# Altium schematic sheet MAIN BOARD V1.3.SchDoc
size A3
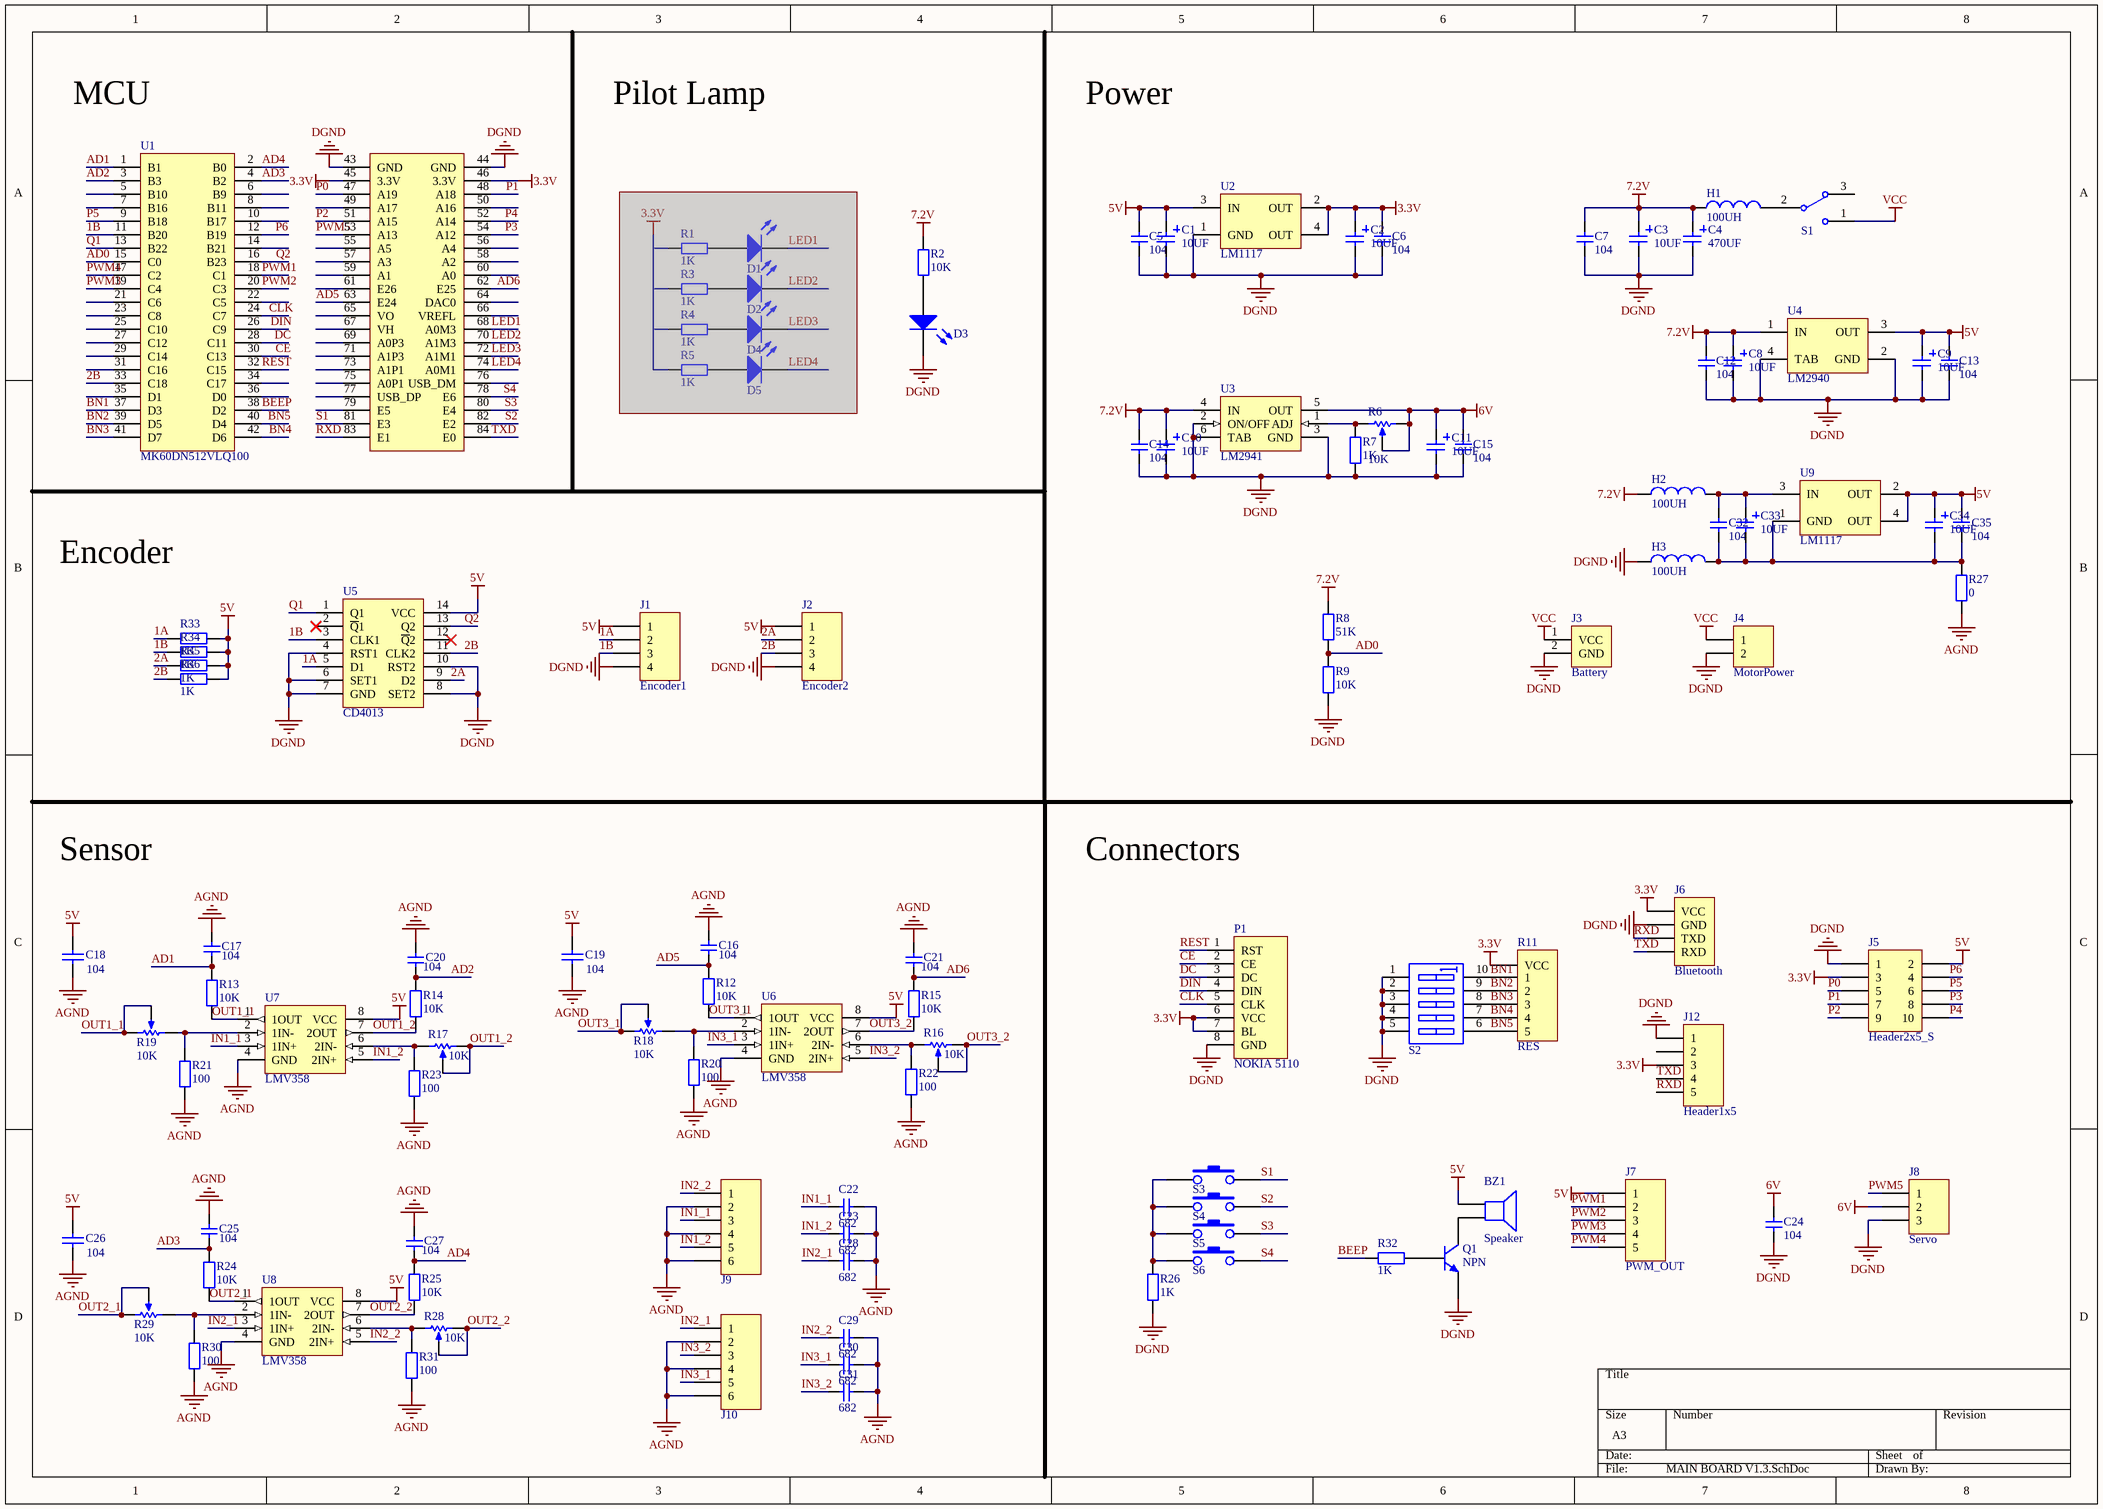
[diagram p0: MAIN BOARD V1.3.SchDoc]

## Parts
BZ1  Speaker  [SPEAKER]
C1  CAP_3216(1206)  [CAP_3216（1206）]  (value not drawn)
C2  CAP_3216(1206)  [CAP_3216（1206）]  (value not drawn)
C3  CAP_3216(1206)  [CAP_3216（1206）]  (value not drawn)
C4  CAP_220UF  [CAP_DIP_8×11.5]  (value not drawn)
C5  CAP_0805  [C0805]  (value not drawn)
C6  CAP_0805  [C0805]  (value not drawn)
C7  CAP_0805  [C0805]  (value not drawn)
C8  CAP_3216(1206)  [CAP_3216（1206）]  (value not drawn)
C9  CAP_3216(1206)  [CAP_3216（1206）]  (value not drawn)
C10  CAP_3216(1206)  [CAP_3216（1206）]  (value not drawn)
C11  CAP_3216(1206)  [CAP_3216（1206）]  (value not drawn)
C12  CAP_0805  [C0805]  (value not drawn)
C13  CAP_0805  [C0805]  (value not drawn)
C14  CAP_0805  [C0805]  (value not drawn)
C15  CAP_0805  [C0805]  (value not drawn)
C16  CAP_0805  [C0805]  (value not drawn)
C17  CAP_0805  [C0805]  (value not drawn)
C18  CAP_0805  [C0805]  (value not drawn)
C19  CAP_0805  [C0805]  (value not drawn)
C20  CAP_0805  [C0805]  (value not drawn)
C21  CAP_0805  [C0805]  (value not drawn)
C22  CAP_682  [CAP_682]  (value not drawn)
C23  CAP_682  [CAP_682]  (value not drawn)
C24  CAP_0805  [C0805]  (value not drawn)
C25  CAP_0805  [C0805]  (value not drawn)
C26  CAP_0805  [C0805]  (value not drawn)
C27  CAP_0805  [C0805]  (value not drawn)
C28  CAP_682  [CAP_682]  (value not drawn)
C29  CAP_682  [CAP_682]  (value not drawn)
C30  CAP_682  [CAP_682]  (value not drawn)
C31  CAP_682  [CAP_682]  (value not drawn)
C32  CAP_0805  [C0805]  (value not drawn)
C33  CAP_3216(1206)  [CAP_3216（1206）]  (value not drawn)
C34  CAP_3216(1206)  [CAP_3216（1206）]  (value not drawn)
C35  CAP_0805  [C0805]  (value not drawn)
D1  LED_0805_R  [LED_0805_R]  (value not drawn)  (masked out: inside a compile mask, not in the netlist)
D2  LED_0805_Y  [LED_0805_Y]  (value not drawn)  (masked out: inside a compile mask, not in the netlist)
D3  LED_3528_R  [LED_3528_R]  (value not drawn)
D4  LED_0805_G  [LED_0805_G]  (value not drawn)  (masked out: inside a compile mask, not in the netlist)
D5  LED_0805_B  [LED_0805_B]  (value not drawn)  (masked out: inside a compile mask, not in the netlist)
H1  Inductor_SMD  [R0805]  (value not drawn)
H2  Inductor_SMD  [R0805]  (value not drawn)
H3  Inductor_SMD  [R0805]  (value not drawn)
J1  Encoder1  [HEADER1X4]
J2  Encoder2  [HEADER1X4]
J3  Battery  [TERMINAL_T]
J4  MotorPower  [HEADER-5.08]
J5  Header2x5_S  [HEADER2X5_S]
J6  Bluetooth  [HEADER1X4]
J7  PWM_OUT  [HEADER1X5]
J8  Servo  [HEADER1X3]
J9  Header1x6  [HEADER1X6]  (value not drawn)
J10  Header1x6  [HEADER1X6]  (value not drawn)
J12  Header1x5  [HEADER1X5]
P1  NOKIA 5110  [NOKIA 5110_1P]
Q1  NPN  [SOT-23]
R1  RES  [R0805]  (value not drawn)  (masked out: inside a compile mask, not in the netlist)
R2  RES  [R0805]  (value not drawn)
R3  RES  [R0805]  (value not drawn)  (masked out: inside a compile mask, not in the netlist)
R4  RES  [R0805]  (value not drawn)  (masked out: inside a compile mask, not in the netlist)
R5  RES  [R0805]  (value not drawn)  (masked out: inside a compile mask, not in the netlist)
R6  RES_Change_P  [RES_Change_P]  (value not drawn)
R7  RES  [R0805]  (value not drawn)
R8  RES  [R0805]  (value not drawn)
R9  RES  [R0805]  (value not drawn)
R11  RES  [RES_6P]
R12  RES  [R0805]  (value not drawn)
R13  RES  [R0805]  (value not drawn)
R14  RES  [R0805]  (value not drawn)
R15  RES  [R0805]  (value not drawn)
R16  RES_Change_W  [RES_Change_W]  (value not drawn)
R17  RES_Change_W  [RES_Change_W]  (value not drawn)
R18  RES_Change_W  [RES_Change_W]  (value not drawn)
R19  RES_Change_W  [RES_Change_W]  (value not drawn)
R20  RES  [R0805]  (value not drawn)
R21  RES  [R0805]  (value not drawn)
R22  RES  [R0805]  (value not drawn)
R23  RES  [R0805]  (value not drawn)
R24  RES  [R0805]  (value not drawn)
R25  RES  [R0805]  (value not drawn)
R26  RES  [R0805]  (value not drawn)
R27  RES  [R0805]  (value not drawn)
R28  RES_Change_W  [RES_Change_W]  (value not drawn)
R29  RES_Change_W  [RES_Change_W]  (value not drawn)
R30  RES  [R0805]  (value not drawn)
R31  RES  [R0805]  (value not drawn)
R32  RES  [R0805]  (value not drawn)
R33  RES  [R0805]  (value not drawn)
R34  RES  [R0805]  (value not drawn)
R35  RES  [R0805]  (value not drawn)
R36  RES  [R0805]  (value not drawn)
S1  SW-2_T  [SW-2 - T]  (value not drawn)
S2  SW  [DIP-10]  (value not drawn)
S3  SW-PB  [BUTTON]  (value not drawn)
S4  SW-PB  [BUTTON]  (value not drawn)
S5  SW-PB  [BUTTON]  (value not drawn)
S6  SW-PB  [BUTTON]  (value not drawn)
U1  MK60DN512VLQ100  [LQ_K60P100]
U2  LM1117  [SOT-223]
U3  LM2941  [TO-263-5S-A]
U4  LM2940  [TO-263-3S]
U5  CD4013  [SOP-14]
U6  LMV358  [SOP-8]
U7  LMV358  [SOP-8]
U8  LMV358  [SOP-8]
U9  LM1117  [SOT-223]

## Nets
3.3V: C2.1 C6.2 J5.3 J6.1(VCC) J12.3 P1.6(VCC) P1.7(BL) R11.6(VCC) U1.45(3.3V) U1.46(3.3V) U2.2(OUT) U2.4(OUT)
5V: BZ1.1 C1.1 C5.2 C9.1 C13.2 C18.2 C19.2 C26.2 C34.1 C35.2 J1.1 J2.1 J5.2 J7.1 R33.2 R34.2 R35.2 R36.2 U2.3(IN) U4.3(OUT) U5.14(VCC) U6.8(VCC) U7.8(VCC) U8.8(VCC) U9.2(OUT) U9.4(OUT)
6V: C11.1 C15.2 C24.2 J8.2 R6.2(BOT) R6.3(TAP) U3.5(OUT)
7.2V: C3.1 C4.1 C7.2 C8.1 C10.1 C12.2 C14.2 H1.1 H2.1 R2.1 R8.2 U3.4(IN) U4.1(IN)
AGND: C16.2 C17.2 C18.1 C19.1 C20.2 C21.2 C22.2 C23.2 C25.2 C26.1 C27.2 C28.2 C29.2 C30.2 C31.2 J9.2 J9.4 J9.6 J10.2 J10.4 J10.6 R20.1 R21.1 R22.1 R23.1 R27.1 R30.1 R31.1 U6.4(GND) U7.4(GND) U8.4(GND)
DGND: C1.2 C2.2 C3.2 C4.2 C5.1 C6.1 C7.1 C8.2 C9.2 C10.2 C11.2 C12.1 C13.1 C14.1 C15.1 C24.1 D3.2(K) H3.1 J1.4 J2.4 J3.2(GND) J4.2 J5.1 J6.2(GND) J8.3 J12.1 P1.8(GND) Q1.2(E) R7.1 R9.1 R26.1 S2.1(A1) S2.2(A2) S2.3(A3) S2.4(A4) S2.5(A5) U1.43(GND) U1.44(GND) U2.1(GND) U3.2(ON/OFF) U3.3(GND) U3.6(TAB) U4.2(GND) U4.4(TAB) U5.4(RST1) U5.6(SET1) U5.7(GND) U5.8(SET2) U5.10(RST2)
VCC: J3.1(VCC) J4.1 S1.1
1A: J1.2 R33.1 U5.5(D1)
1B: J1.3 R34.1 U1.11(B20) U5.3(CLK1)
2A: J2.2 R35.1 U5.9(D2)
2B: J2.3 R36.1 U1.33(C18) U5.11(CLK2)
AD0: R8.1 R9.2 U1.15(C0)
AD1: C17.1 R13.1 U1.1(B1)
AD2: C20.1 R14.1 U1.3(B3)
AD3: C25.1 R24.1 U1.4(B2)
AD4: C27.1 R25.1 U1.2(B0)
AD5: C16.1 R12.1 U1.63(E24)
AD6: C21.1 R15.1 U1.62(E25)
BEEP: R32.1 U1.38(D2)
BN1: R11.1 S2.10(B3) U1.37(D3)
BN2: R11.2 S2.9(B4) U1.39(D5)
BN3: R11.3 S2.8(B5) U1.41(D7)
BN4: R11.4 S2.7(B6) U1.42(D6)
BN5: R11.5 S2.6(A6) U1.40(D4)
CE: P1.2(CE) U1.30(C13)
CLK: P1.5(CLK) U1.24(C7)
DC: P1.3(DC) U1.28(C11)
DIN: P1.4(DIN) U1.26(C9)
IN1_1: C22.1 J9.3 U7.3(1IN+)
IN1_2: C23.1 J9.5 U7.5(2IN+)
IN2_1: C28.1 J10.1 U8.3(1IN+)
IN2_2: C29.1 J9.1 U8.5(2IN+)
IN3_1: C30.1 J10.5 U6.3(1IN+)
IN3_2: C31.1 J10.3 U6.5(2IN+)
LED1: U1.68(A0M3)
LED2: U1.70(A1M3)
LED3: U1.72(A1M1)
LED4: U1.74(A0M1)
OUT1_1: R13.2 R19.2(BOT) R19.3(TAP) U7.1(1OUT)
OUT1_2: R14.2 R17.2(BOT) R17.3(TAP) U7.7(2OUT)
OUT2_1: R24.2 R29.2(BOT) R29.3(TAP) U8.1(1OUT)
OUT2_2: R25.2 R28.2(BOT) R28.3(TAP) U8.7(2OUT)
OUT3_1: R12.2 R18.2(BOT) R18.3(TAP) U6.1(1OUT)
OUT3_2: R15.2 R16.2(BOT) R16.3(TAP) U6.7(2OUT)
P0: J5.5 U1.47(A19)
P1: J5.7 U1.48(A18)
P2: J5.9 U1.51(A15)
P3: J5.8 U1.54(A12)
P4: J5.10 U1.52(A14)
P5: J5.6 U1.9(B18)
P6: J5.4 U1.12(B19)
PWM1: J7.2 U1.18(C1)
PWM2: J7.3 U1.20(C3)
PWM3: J7.4 U1.19(C4)
PWM4: J7.5 U1.17(C2)
PWM5: J8.1 U1.53(A13)
Q1: U1.13(B22) U5.1(Q1)
Q2: U1.16(B23) U5.13(Q2)
REST: P1.1(RST) U1.32(C15)
RXD: J6.3(TXD) J12.5 U1.83(E1)
S1: S3.2 U1.81(E3)
S2: S4.2 U1.82(E2)
S3: S5.2 U1.80(E4)
S4: S6.2 U1.78(E6)
TXD: J6.4(RXD) J12.4 U1.84(E0)
NetBZ1_2: BZ1.2 Q1.3(C)
NetC32_1: C32.1 C33.2 C34.2 C35.1 H3.2 R27.2 U9.1(GND)
NetC32_2: C32.2 C33.1 H2.2 U9.3(IN)
NetD3_1: D3.1(A) R2.2
NetH1_2: H1.2 S1.2
NetQ1_1: Q1.1(B) R32.2
NetR6_1: R6.1(TOP) R7.2 U3.1(ADJ)
NetR16_1: R16.1(TOP) R22.2 U6.6(2IN-)
NetR17_1: R17.1(TOP) R23.2 U7.6(2IN-)
NetR18_1: R18.1(TOP) R20.2 U6.2(1IN-)
NetR19_1: R19.1(TOP) R21.2 U7.2(1IN-)
NetR26_2: R26.2 S3.1 S4.1 S5.1 S6.1
NetR28_1: R28.1(TOP) R31.2 U8.6(2IN-)
NetR29_1: R29.1(TOP) R30.2 U8.2(1IN-)

Not connected (* = marked no-connect by the designer): J12 2; S1 3; U1 5(B10) 6(B9) 7(B16) 8(B11) 10(B17) 14(B21) 21(C6) 22(C5) 23(C8) 25(C10) 27(C12) 29(C14) 31(C16) 34(C17) 35(D1) 36(D0) 49(A17) 50(A16) 55(A5) 56(A4) 57(A3) 58(A2) 59(A1) 60(A0) 61(E26) 64(DAC0) 65(VO) 66(VREFL) 67(VH) 69(A0P3) 71(A1P3) 73(A1P1) 75(A0P1) 76(USB_DM) 77(USB_DP) 79(E5); U5 2(~{Q}1)* 12(~{Q}2)*

## Notes on the sheet
- MCU
- Pilot Lamp
- Power
- Encoder
- Sensor
- Connectors
- (in symbol CAP_220UF) 470UF
- (in symbol CAP_682) 682
- (in symbol CAP_0805) 104
- (in symbol CAP_3216(1206)) 10UF
- (in symbol Inductor_SMD) 100UH
- (in symbol RES) 10K; 51K; 1K; 100; 0
- (in symbol RES_Change_P) 10K
- (in symbol RES_Change_W) 10K

## Library data of the parts
BZ1 = Speaker: Loudspeaker; Published: 24-Mar-1999; LatestRevisionDate: 17-Jul-2002; LatestRevisionNote: Re-released for DXP Platform.; PackageReference: PIN2; Publisher: Altium Limited
J1 J2 = Header1x4
J3 = Header-T
J4 = Header-5.08
J6 = Blutooth
J7 = Header1x5
J8 = Header1x3
P1 = Nokia 5110 _1P
Q1 = NPN(SOT-23): NPN Bipolar Transistor; Published: 8-Jun-2000; LatestRevisionDate: 17-Jul-2002; LatestRevisionNote: Re-released for DXP Platform.; PackageReference: TO-226; Publisher: Altium Limited; Code_JEDEC: TO-226-AA
R11 = RES_ARRAY_6P
S2 = SW-DIP5
U1 = LQ_K60P100
U2 U9 = LM1117_SOT_223
U3 = LM2941_A
U4 = LM2940_TO_263
U5 = CD4013BM